# EAGLE design pcb 12v stabiliser (EAGLE 8.6.3)
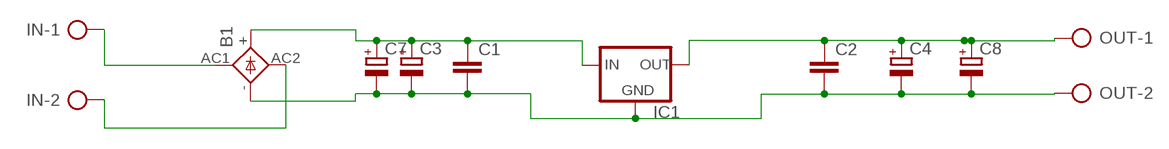
[diagram p0: schematic, sheet 1]

## Parts
B1  2KBB-R  [2KBB-R]
C1  C5/5  [C5B5]
C2  C5/5  [C5B5]
C3  CPOL-EUE5-8.5  [E5-8,5]
C4  CPOL-EUE5-8.5  [E5-8,5]
C7  CPOL-EUE5-10.5  [E5-10,5]
C8  CPOL-EUE5-10.5  [E5-10,5]
IC1  78XXS  [78XXS]
IN  AK500/2-H  [AK500/2-H]
OUT  AK500/2-H  [AK500/2-H]

## Nets
GND: B1.- C1.2 C2.2 C3.- C4.- C7.- C8.- IC1.GND OUT.2
N$1: B1.AC1 IN.1
N$2: B1.AC2 IN.2
N$4: B1.+ C1.1 C3.+ C7.+ IC1.IN
N$5: C2.1 C4.+ C8.+ IC1.OUT OUT.1

## Library data of the parts
B1 = rectifier:2KBB-R: RECTIFIER grid 3 x 5 mm
C1 C2 = capacitor-wima:C: CAPACITOR naming: grid - package width
C3 C4 = rcl:CPOL-EU: POLARIZED CAPACITOR, European symbol; SPICEPREFIX: C
C7 C8 = resistor:CPOL-EU: POLARIZED CAPACITOR, European symbol
IC1 = v-reg:78XXS: VOLTAGE REGULATOR
IN OUT = con-ptr500:AK500/2-H: CONNECTOR Aug. 2004 / PTR Meßtechnik: Die Bezeichnung der Serie AK505 wurde geändert. Es handelt sich hierbei um AK500 in horizontaler Ausführung.; OC_FARNELL: unknown; OC_NEWARK: unknown

## Board
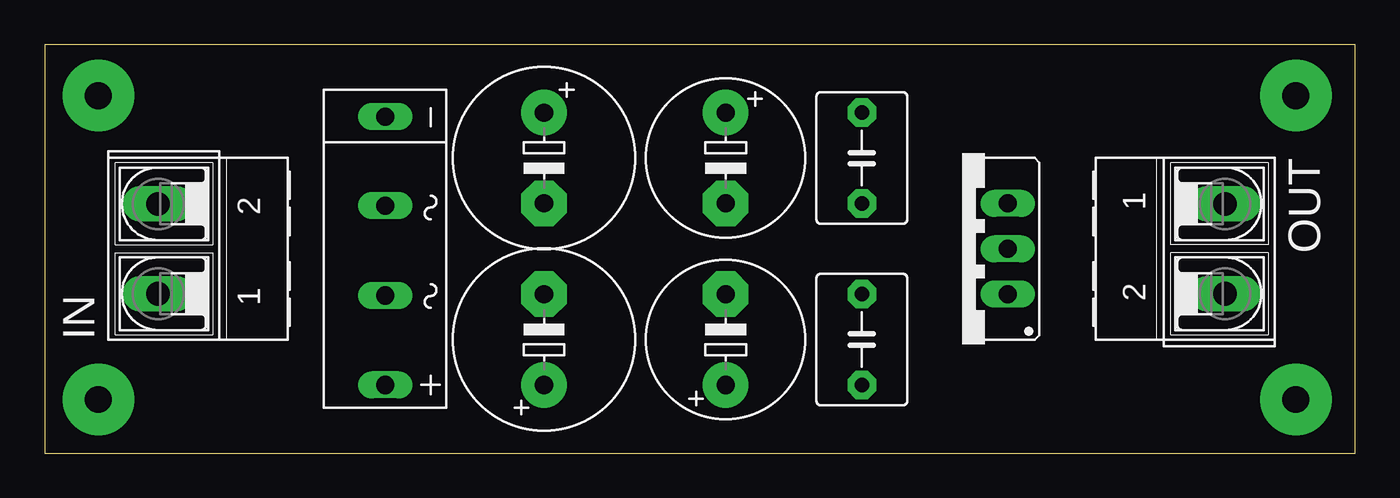
[diagram p1: board, top side]
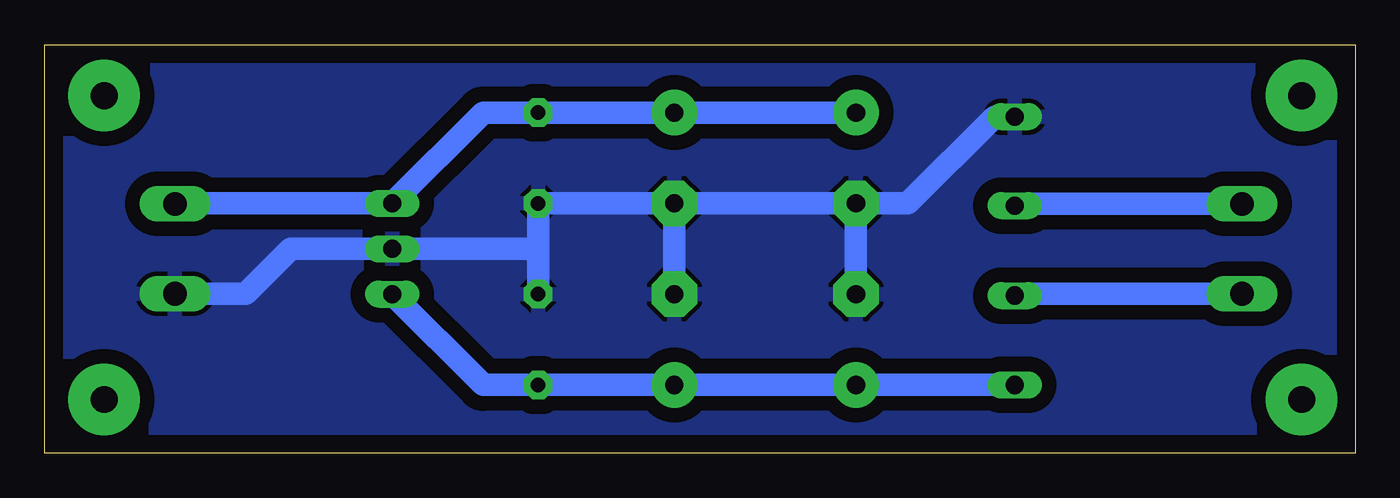
[diagram p2: board, bottom side, seen from below]

Size 73.33 x 22.85 mm. Coordinates in mm from the lower left corner, seen from the top.
Outline: 0,0 73.33,0 73.33,22.85 0,22.85 0,0
Copper layers (1*16): Top 0.035mm / dielectric 1.5mm / Bottom 0.035mm
Design rules "default": minimum track width 6mil, minimum drill 0.35mm, track to track 6mil, track to pad 6mil, pad to pad 6mil, via to via 6mil, smd to smd 6mil, copper to edge 40mil, drill to drill 6mil, minimum pad ring 10mil, minimum via ring 8mil, stop-mask expansion 4mil, vias tented up to drill 0mil, thermal gap 10mil

### Footprints (pad centres in the part's own frame; a part is rotated, then mirrored left to right if it is on the bottom)
2KBB-R = drill 1.016 long: + -7.62,0; - 7.391,0; AC1 -2.616,0; AC2 2.413,0
C5B5 = drill 0.813 pad 1.6 octagon: 1 -2.54,0; 2 2.54,0
E5-8,5 = drill 1.016 pad 2.54: + -2.54,0 | drill 1.016 pad 2.54 octagon: - 2.54,0
E5-10,5 = drill 1.016 pad 2.54: + -2.54,0 | drill 1.016 pad 2.54 octagon: - 2.54,0
78XXS = drill 1.016 long: GND 0,-2.54; IN -2.54,-2.54; OUT 2.54,-2.54
AK500/2-H = drill 1.321 long: 1 -2.515,0; 2 2.515,0

### Placement (x,y rotation side)
B1  19.05,11.43 90 top
C1  45.72,6.35 90 top
C2  45.72,16.51 270 top
C3  38.1,6.35 90 top
C4  38.1,16.51 270 top
C7  27.94,6.35 90 top
C8  27.94,16.51 270 top
IC1  51.34,11.43 90 top
IN  6.35,11.43 90 top
OUT  66.04,11.43 270 top

### Tracks (layer width: path | path; a pad name or v marks a point on that pad's centre or on a via)
GND
  Bottom 1.27: B1.- 20.18,18.82 25.03,13.97 C8.- | C8.- C4.- | C4.- C2.2 45.72,11 | C8.- C7.- | C3.- C4.- | C1.2 45.72,11 | 45.72,11 46.15,11.43 IC1.GND 59.57,11.43 62.09,8.91 OUT.2
  pour Bottom (isolate 0.813): 0,0 0,23 73,23 73,0
N$1
  Bottom 1.27: IN.1 18.95,8.91 B1.AC1
N$2
  Bottom 1.27: IN.2 18.95,13.95 B1.AC2
N$3  (via drill 1.5 pad 4)
  other vias: 3,20
N$4
  Bottom 1.27: B1.+ C7.+ C3.+ C1.1 48.8,3.81 IC1.IN
N$5
  Bottom 1.27: OUT.1 66.02,13.97 IC1.OUT 48.8,19.05 C2.1 C4.+ C8.+
N$6  (via drill 1.5 pad 4)
  other vias: 3,3
N$7  (via drill 1.5 pad 4)
  other vias: 70,20
N$8  (via drill 1.5 pad 4)
  other vias: 70,3

### Text on the board
tValues: + | +